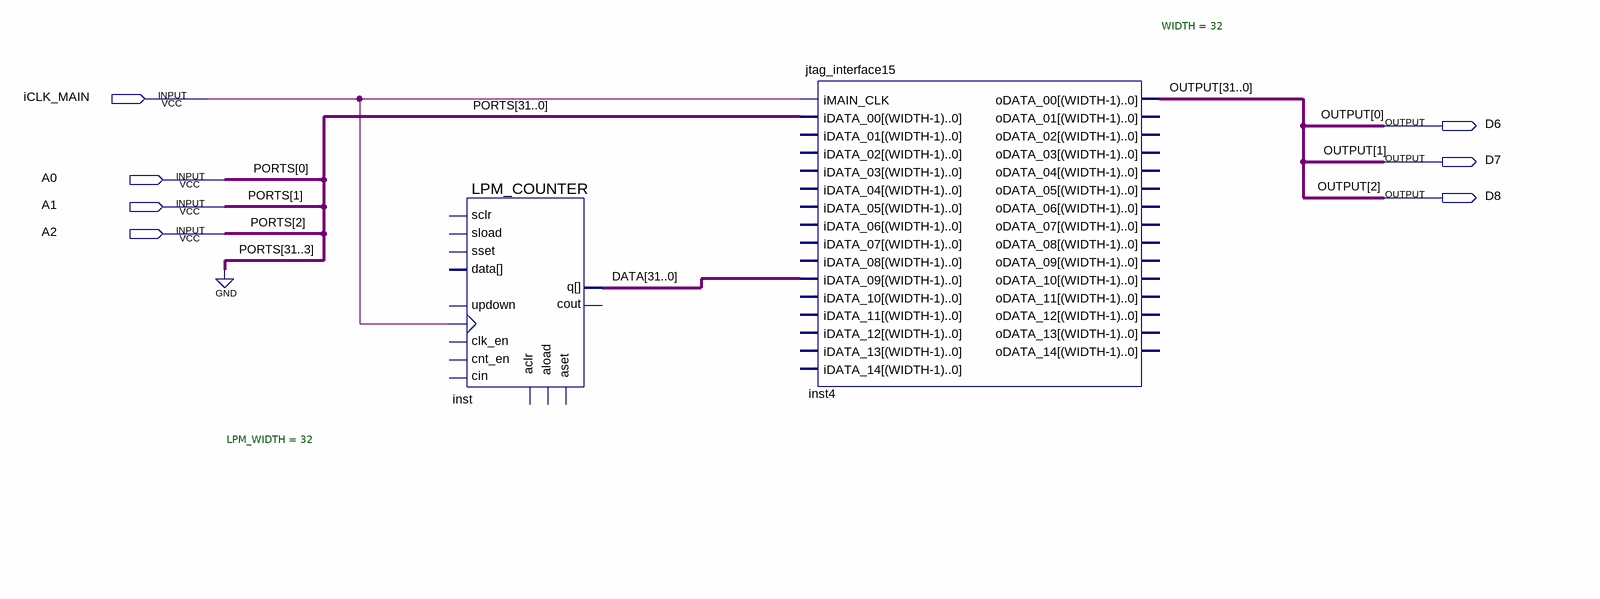
[diagram p0: schematic sheet]
// Quartus schematic MyDesign.bdf as structural Verilog: 2 symbols, 7 pins
module MyDesign (
  input  iCLK_MAIN,
  input  A0,
  input  A1,
  input  A2,
  output D6,
  output D7,
  output D8
);

  wire [31:0] DATA;
  wire [31:3] OUTPUT;

  LPM_COUNTER #(.LPM_WIDTH(32)) inst (
    .clock(iCLK_MAIN), .q(DATA));  // open: sload, data, clk_en, aload, aclr, aset, cin, sset, updown, cnt_en, sclr, cout
  jtag_interface15 #(.WIDTH(32)) inst4 (
    .iMAIN_CLK(iCLK_MAIN), .iDATA_00({{29{1'b0}}, A2, A1, A0}), .iDATA_09(DATA),
    .oDATA_00({OUTPUT, D8, D7, D6}));  // open: iDATA_01, iDATA_02, iDATA_03, iDATA_04, iDATA_05, iDATA_06, iDATA_07, iDATA_08, iDATA_10, iDATA_11, iDATA_12, iDATA_13, iDATA_14, oDATA_01, oDATA_02, oDATA_03, oDATA_04, oDATA_05, oDATA_06, oDATA_07, oDATA_08, oDATA_09, oDATA_10, oDATA_11, oDATA_12, oDATA_13, oDATA_14

  // Other names for the same wires on the sheet: OUTPUT[2:0] = {D8, D7, D6}; PORTS[2:0] = {A2, A1, A0}
endmodule
